# Altium schematic sheet GPIO Test.SchDoc
size A
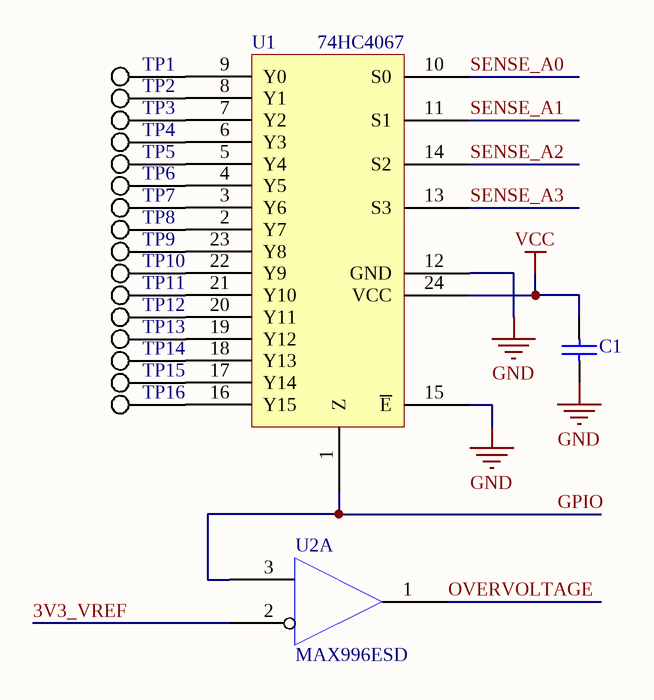
[diagram p0: GPIO Test.SchDoc]

## Parts
C1  Cap chip  [CAPC3216]  (value not drawn)
TP1  Test point  (value not drawn)
TP2  Test point  (value not drawn)
TP3  Test point  (value not drawn)
TP4  Test point  (value not drawn)
TP5  Test point  (value not drawn)
TP6  Test point  (value not drawn)
TP7  Test point  (value not drawn)
TP8  Test point  (value not drawn)
TP9  Test point  (value not drawn)
TP10  Test point  (value not drawn)
TP11  Test point  (value not drawn)
TP12  Test point  (value not drawn)
TP13  Test point  (value not drawn)
TP14  Test point  (value not drawn)
TP15  Test point  (value not drawn)
TP16  Test point  (value not drawn)
U1  74HC4067  [SO24]
U2  MAX996ESD  [SOIC-14]  (part A of 4)

## Nets
GND: C1.1 U1.12(GND) U1.15(~{E})
VCC: C1.2 U1.24(VCC)
3V3_VREF: U2.2(-IN1)
GPIO: U1.1(Z) U2.3(+IN1)
OVERVOLTAGE: U2.1(OUT1)
SENSE_A0: U1.10(S0)
SENSE_A1: U1.11(S1)
SENSE_A2: U1.14(S2)
SENSE_A3: U1.13(S3)
NetTP1_1: TP1.1 U1.9(Y0)
NetTP2_1: TP2.1 U1.8(Y1)
NetTP3_1: TP3.1 U1.7(Y2)
NetTP4_1: TP4.1 U1.6(Y3)
NetTP5_1: TP5.1 U1.5(Y4)
NetTP6_1: TP6.1 U1.4(Y5)
NetTP7_1: TP7.1 U1.3(Y6)
NetTP8_1: TP8.1 U1.2(Y7)
NetTP9_1: TP9.1 U1.23(Y8)
NetTP10_1: TP10.1 U1.22(Y9)
NetTP11_1: TP11.1 U1.21(Y10)
NetTP12_1: TP12.1 U1.20(Y11)
NetTP13_1: TP13.1 U1.19(Y12)
NetTP14_1: TP14.1 U1.18(Y13)
NetTP15_1: TP15.1 U1.17(Y14)
NetTP16_1: TP16.1 U1.16(Y15)

## Library data of the parts
C1 = Cap chip: Chip Capacitor; Value: 0.01uF; Published: 8-Jun-2000; LatestRevisionDate: 17-Jul-2002; LatestRevisionNote: Re-released for DXP Platform.; PackageReference: RAD-0.3; Publisher: Altium Limited; Supplier 1: Digi-Key; Supplier Part Number 1: 399-1249-1-ND
TP1-TP16 = Pogo Test Pin
U1 = 74HC4067; 74HCT4067: 16-channel analog multiplexer/demultiplexer
U2 = MAX996ESD: High-Speed, Micropower, Low-Voltage,  Rail-to-Rail I/O Comparators